# Altium schematic sheet wlpkt1_pk.SchDoc: Przekaźniki wykonawczy
size A4; DocumentNumber: 5; SheetNumber: 5; SheetTotal: 5
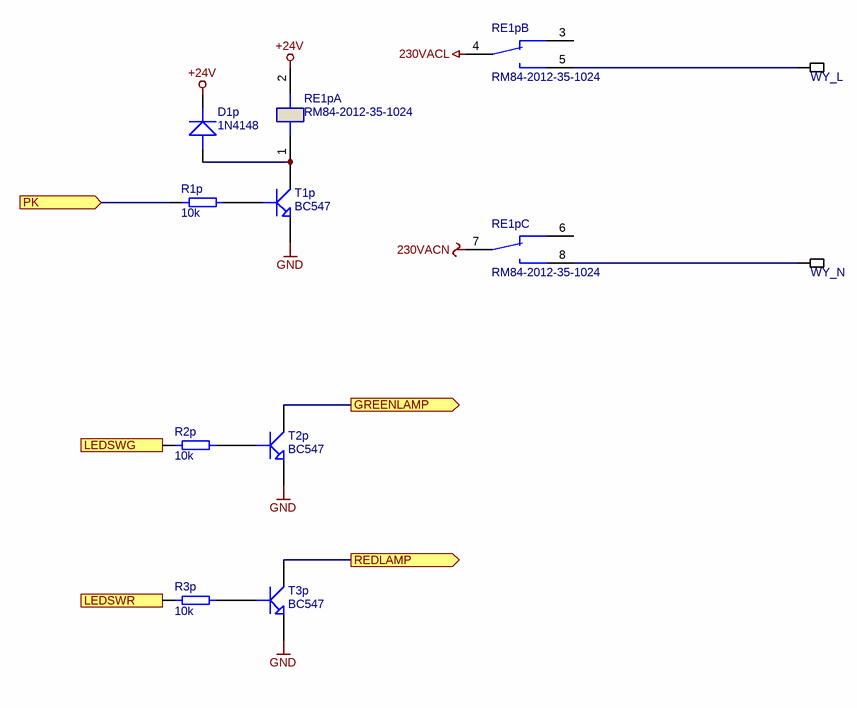
[diagram p0: wlpkt1_pk.SchDoc]

## Parts
D1p  1N4148  [CE02]
R1p  10k  [0805R]
R2p  10k  [0805R]
R3p  10k  [0805R]
RE1p  RM84-2012-35-1024  [RM84-P]  (parts A,B,C of 3)
T1p  BC547  [CE35V4]
T2p  BC547  [CE35V4]
T3p  BC547  [CE35V4]
WY_L  PAD1_5MM  [PAD1_5MM]  (value not drawn)  (no BOM)
WY_N  PAD1_5MM  [PAD1_5MM]  (value not drawn)  (no BOM)

## Ports
GREENLAMP (out), LEDSWG (in), LEDSWR (in), PK (in), REDLAMP (out)

## Nets
230VACL: RE1p.4
230VACN: RE1p.7
+24V: D1p.CATH RE1p.2(A2)
GND: T1p.EMIT T2p.EMIT T3p.EMIT
GREENLAMP: T2p.COLL ; port GREENLAMP
LEDSWG: R2p.2 ; port LEDSWG
LEDSWR: R3p.2 ; port LEDSWR
PK: R1p.2 ; port PK
REDLAMP: T3p.COLL ; port REDLAMP
NetD1p_ANOD: D1p.ANOD RE1p.1(A1) T1p.COLL
NetR1p_1: R1p.1 T1p.BASE
NetR2p_1: R2p.1 T2p.BASE
NetR3p_1: R3p.1 T3p.BASE
NetRE1p_5: RE1p.5 WY_L.1
NetRE1p_8: RE1p.8 WY_N.1

Not connected (* = marked no-connect by the designer): RE1p 3(22) 6(12)

## Notes on the sheet
- Jeżeli nie wskazano inaczej, tolerancja rezystorów wynosi 1%
- Nazwa modułu (skrót)
- Słowna nazwa modułu
- Rozmiar arkusza
- A4
- Projektował
- Rysował
- Podpis
- Data:
- Ark.
- z
- Wer.

## Library data of the parts
D1p = DIO2: Kod: DIO2; ID: 2; Descript: Dioda: przełączająca; 100V; 300mA; 2A; DO35; Typ5: 1N4148-TAP; Value: 1N4148; Price5: 0,3; DateOfPrice5: 2020-11-08; Supplier5: tme.pl; Reference5: 1N4148; Manufacturer5: Vishay
R1p R2p R3p = Res16: Kod: Res16; ID: 16; Descript: Rezystor: thick film; SMD; 0805; 10kom; 0,125W; ±1%; -55÷125°C; Reference5: SMD0805-10K-1%; Typ5: 0805S8F1002T5E; Value: 10k; Price5: 0,1; DateOfPrice5: 2020-06-25; Supplier5: tme.pl; Manufacturer5: Royal Ohm
RE1p = Rel14: Kod: Rel14; ID: 14; Descript: Przekaźnik: elektromagnetyczny; DPDT; Ucewki : 24VDC; 8A/250VAC; Value: RM84-2012-35-1024; Price5: 6,5; DateOfPrice5: 2010-01-01; Supplier5: tme.pl; Reference5: RM84-2012-35-1024; Manufacturer5: Relpol; Typ5: RM84-2012-35-1024
T1p T2p T3p = Tra9: Kod: Tra9; ID: 9; Descript: Tranzystor: NPN; bipolarny; 50V; 100mA; 500mW; TO92; Reference5: BC547A; Value: BC547; Price5: 0,1; DateOfPrice5: 2010-01-01; Supplier5: tme.pl; Manufacturer5: Diotec; Typ5: BC547A
WY_L WY_N = NOB33: Kod: NOB33; ID: 33; Descript: bd; Value: PAD1_5MM